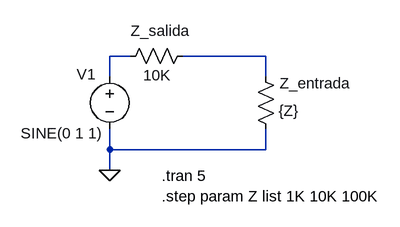
[diagram p0: schematic impedancia-entrada-salida.asc]
impedancia-entrada-salida.asc, the LTspice schematic file:
Version 4
SHEET 1 880 680
WIRE 320 112 288 112
WIRE 528 112 400 112
WIRE 288 144 288 112
WIRE 528 144 528 112
WIRE 288 256 288 224
WIRE 528 256 528 224
WIRE 528 256 288 256
WIRE 288 288 288 256
FLAG 288 288 0
SYMBOL res 512 128 R0
WINDOW 0 37 26 Left 2
WINDOW 3 36 68 Left 2
SYMATTR InstName Z_entrada
SYMATTR Value {Z}
SYMBOL res 416 96 R90
WINDOW 0 -7 50 VBottom 2
WINDOW 3 61 55 VBottom 2
SYMATTR InstName Z_salida
SYMATTR Value 10K
SYMBOL voltage 288 128 R0
WINDOW 0 -51 12 Left 2
WINDOW 3 -137 103 Left 2
WINDOW 123 0 0 Left 0
WINDOW 39 0 0 Left 0
SYMATTR InstName V1
SYMATTR Value SINE(0 1 1)
TEXT 368 296 Left 2 !.tran 5
TEXT 368 328 Left 2 !.step param Z list 1K 10K 100K

The netlist it stands for:
* impedancia-entrada-salida.asc
R§Z_entrada N002 0 {Z}
R§Z_salida N002 N001 10K
V1 N001 0 SINE(0 1 1)
.tran 5
.step param Z list 1K 10K 100K
.backanno
.end